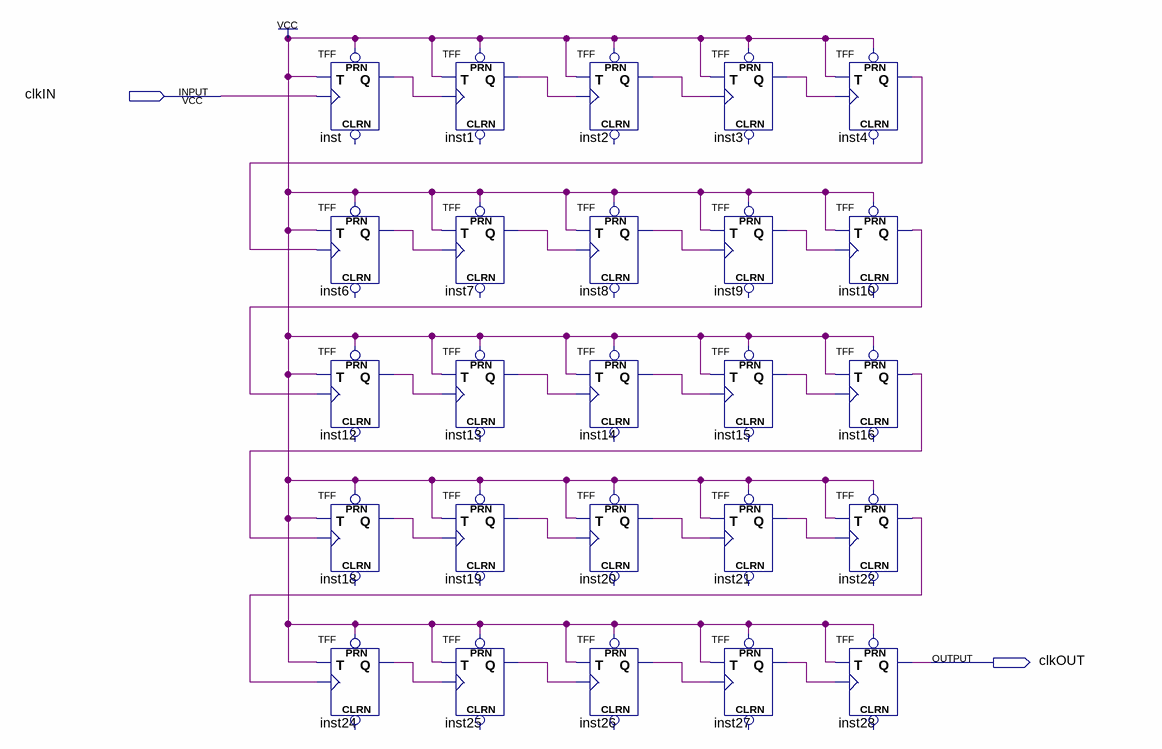
[diagram p0: schematic sheet]
// Quartus schematic div_freq_32Mhz_1hz.bdf as structural Verilog: 25 symbols, 2 pins
module div_freq_32Mhz_1hz (
  input  clkIN,
  output clkOUT
);

  wire inst1_q, inst2_q, inst3_q, inst4_q, inst6_q, inst7_q, inst8_q, inst9_q, inst10_q, inst12_q, inst13_q,
       inst14_q, inst15_q, inst16_q, inst18_q, inst19_q, inst20_q, inst21_q, inst22_q, inst24_q, inst25_q,
       inst26_q, inst27_q, inst_q;

  TFF inst (.PRN(1'b1), .T(1'b1), .CLK(clkIN), .Q(inst_q));  // open: CLRN
  TFF inst6 (.PRN(1'b1), .T(1'b1), .CLK(inst4_q), .Q(inst6_q));  // open: CLRN
  TFF inst12 (.PRN(1'b1), .T(1'b1), .CLK(inst10_q), .Q(inst12_q));  // open: CLRN
  TFF inst18 (.PRN(1'b1), .T(1'b1), .CLK(inst16_q), .Q(inst18_q));  // open: CLRN
  TFF inst24 (.PRN(1'b1), .T(1'b1), .CLK(inst22_q), .Q(inst24_q));  // open: CLRN
  TFF inst1 (.PRN(1'b1), .T(1'b1), .CLK(inst_q), .Q(inst1_q));  // open: CLRN
  TFF inst7 (.PRN(1'b1), .T(1'b1), .CLK(inst6_q), .Q(inst7_q));  // open: CLRN
  TFF inst13 (.PRN(1'b1), .T(1'b1), .CLK(inst12_q), .Q(inst13_q));  // open: CLRN
  TFF inst19 (.PRN(1'b1), .T(1'b1), .CLK(inst18_q), .Q(inst19_q));  // open: CLRN
  TFF inst25 (.PRN(1'b1), .T(1'b1), .CLK(inst24_q), .Q(inst25_q));  // open: CLRN
  TFF inst2 (.PRN(1'b1), .T(1'b1), .CLK(inst1_q), .Q(inst2_q));  // open: CLRN
  TFF inst8 (.PRN(1'b1), .T(1'b1), .CLK(inst7_q), .Q(inst8_q));  // open: CLRN
  TFF inst14 (.PRN(1'b1), .T(1'b1), .CLK(inst13_q), .Q(inst14_q));  // open: CLRN
  TFF inst20 (.PRN(1'b1), .T(1'b1), .CLK(inst19_q), .Q(inst20_q));  // open: CLRN
  TFF inst26 (.PRN(1'b1), .T(1'b1), .CLK(inst25_q), .Q(inst26_q));  // open: CLRN
  TFF inst3 (.PRN(1'b1), .T(1'b1), .CLK(inst2_q), .Q(inst3_q));  // open: CLRN
  TFF inst9 (.PRN(1'b1), .T(1'b1), .CLK(inst8_q), .Q(inst9_q));  // open: CLRN
  TFF inst15 (.PRN(1'b1), .T(1'b1), .CLK(inst14_q), .Q(inst15_q));  // open: CLRN
  TFF inst21 (.PRN(1'b1), .T(1'b1), .CLK(inst20_q), .Q(inst21_q));  // open: CLRN
  TFF inst27 (.PRN(1'b1), .T(1'b1), .CLK(inst26_q), .Q(inst27_q));  // open: CLRN
  TFF inst4 (.PRN(1'b1), .T(1'b1), .CLK(inst3_q), .Q(inst4_q));  // open: CLRN
  TFF inst10 (.PRN(1'b1), .T(1'b1), .CLK(inst9_q), .Q(inst10_q));  // open: CLRN
  TFF inst16 (.PRN(1'b1), .T(1'b1), .CLK(inst15_q), .Q(inst16_q));  // open: CLRN
  TFF inst22 (.PRN(1'b1), .T(1'b1), .CLK(inst21_q), .Q(inst22_q));  // open: CLRN
  TFF inst28 (.PRN(1'b1), .T(1'b1), .CLK(inst27_q), .Q(clkOUT));  // open: CLRN
endmodule
